# EAGLE design KREM Board (EAGLE 9.3.1)
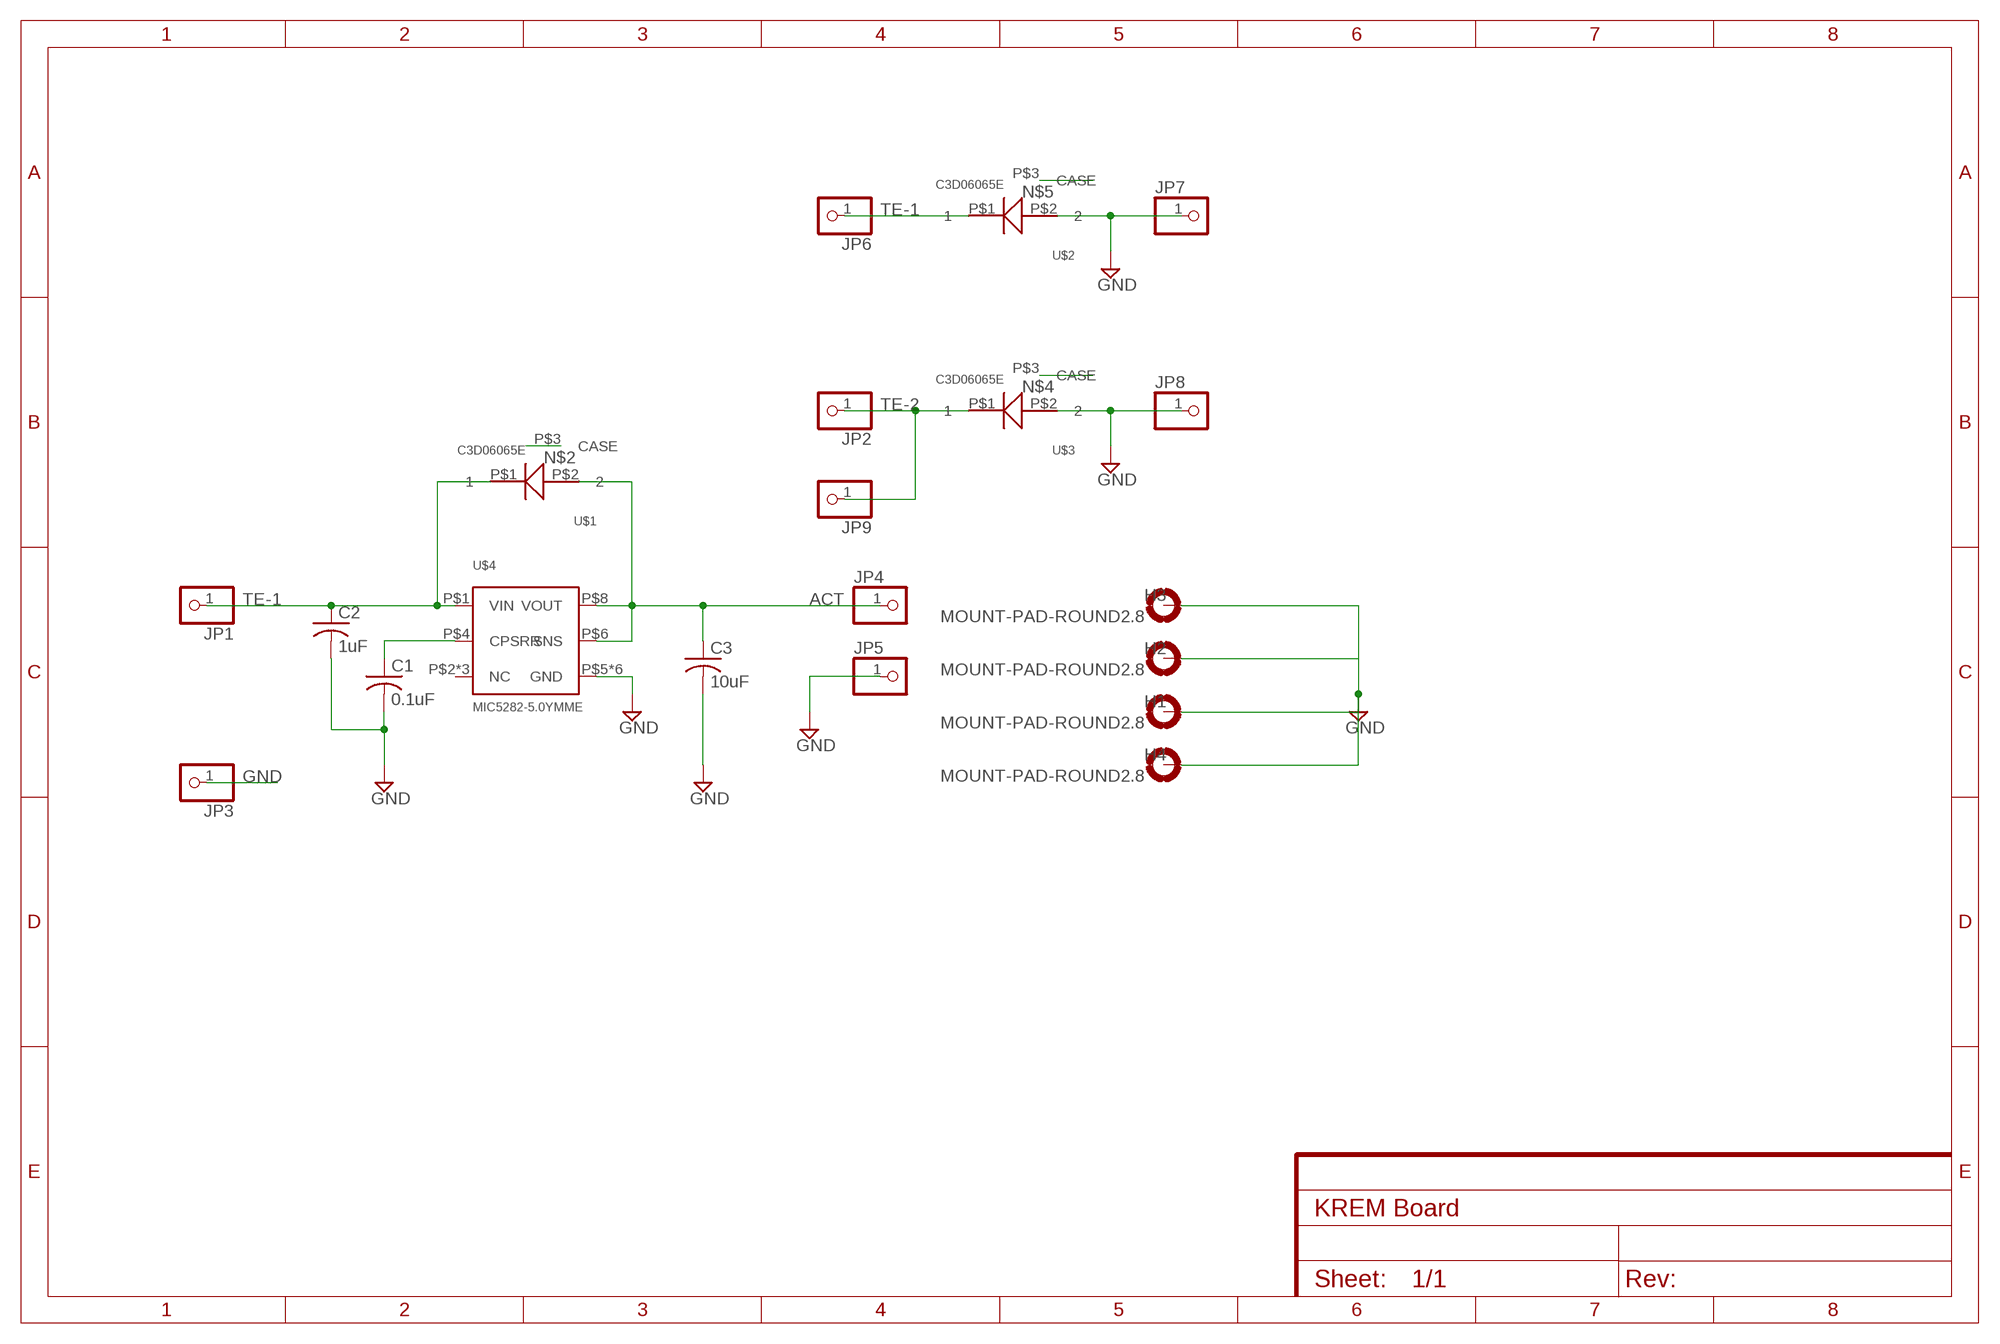
[diagram p0: schematic, sheet 1]

## Parts
C1  0.1uF  C-USC2220K  [C2220K]
C2  1uF  C-USC2220K  [C2220K]
C3  10uF  C-USC2220K  [C2220K]
H1  MOUNT-PAD-ROUND2.8  [2,8-PAD]
H2  MOUNT-PAD-ROUND2.8  [2,8-PAD]
H3  MOUNT-PAD-ROUND2.8  [2,8-PAD]
H4  MOUNT-PAD-ROUND2.8  [2,8-PAD]
JP1  PINHD-1X1  [1X01]
JP2  PINHD-1X1  [1X01]
JP3  PINHD-1X1  [1X01]
JP4  PINHD-1X1  [1X01]
JP5  PINHD-1X1  [1X01]
JP6  PINHD-1X1  [1X01]
JP7  PINHD-1X1  [1X01]
JP8  PINHD-1X1  [1X01]
JP9  PINHD-1X1  [1X01]
U$1  C3D06065E  [TO-252]
U$2  C3D06065E  [TO-252]
U$3  C3D06065E  [TO-252]
U$4  MIC5282-5.0YMME  [MSOP8-EPAD]

## Nets
ACT: C3.1 JP4.1 U$1.P$2 U$4.P$6(SNS) U$4.P$8(VOUT)
GND: C1.2 C2.2 C3.2 H1.B2,8(MOUNT) H2.B2,8(MOUNT) H3.B2,8(MOUNT) H4.B2,8(MOUNT) JP3.1 JP5.1 JP7.1 JP8.1 U$2.P$2 U$3.P$2 U$4.P$5(GND) U$4.P$9(GND) U$4.P$10(GND) U$4.P$11(GND) U$4.P$12(GND) U$4.P$13(GND)
N$2: U$1.P$3(CASE)
N$3: C1.1 U$4.P$4(CPSRR)
N$4: U$3.P$3(CASE)
N$5: U$2.P$3(CASE)
TE-1: C2.1 JP1.1 JP6.1 U$1.P$1 U$2.P$1 U$4.P$1(VIN)
TE-2: JP2.1 JP9.1 U$3.P$1
Unconnected: U$4.P$2(NC) U$4.P$3(NC) U$4.P$7(NC)

## Library data of the parts
C1-C3 = adafruit:C-US: CAPACITOR, American symbol
H1-H4 = holes:MOUNT-PAD-ROUND: MOUNTING PAD, round
JP1-JP9 = adafruit:PINHD-1X1: Pin header 1x1 for 0.1" spacing With round pins
U$1-U$3 = TI_radio:C3D06065E
U$4 = TI_radio:MIC5282-5.0YMME

## Board
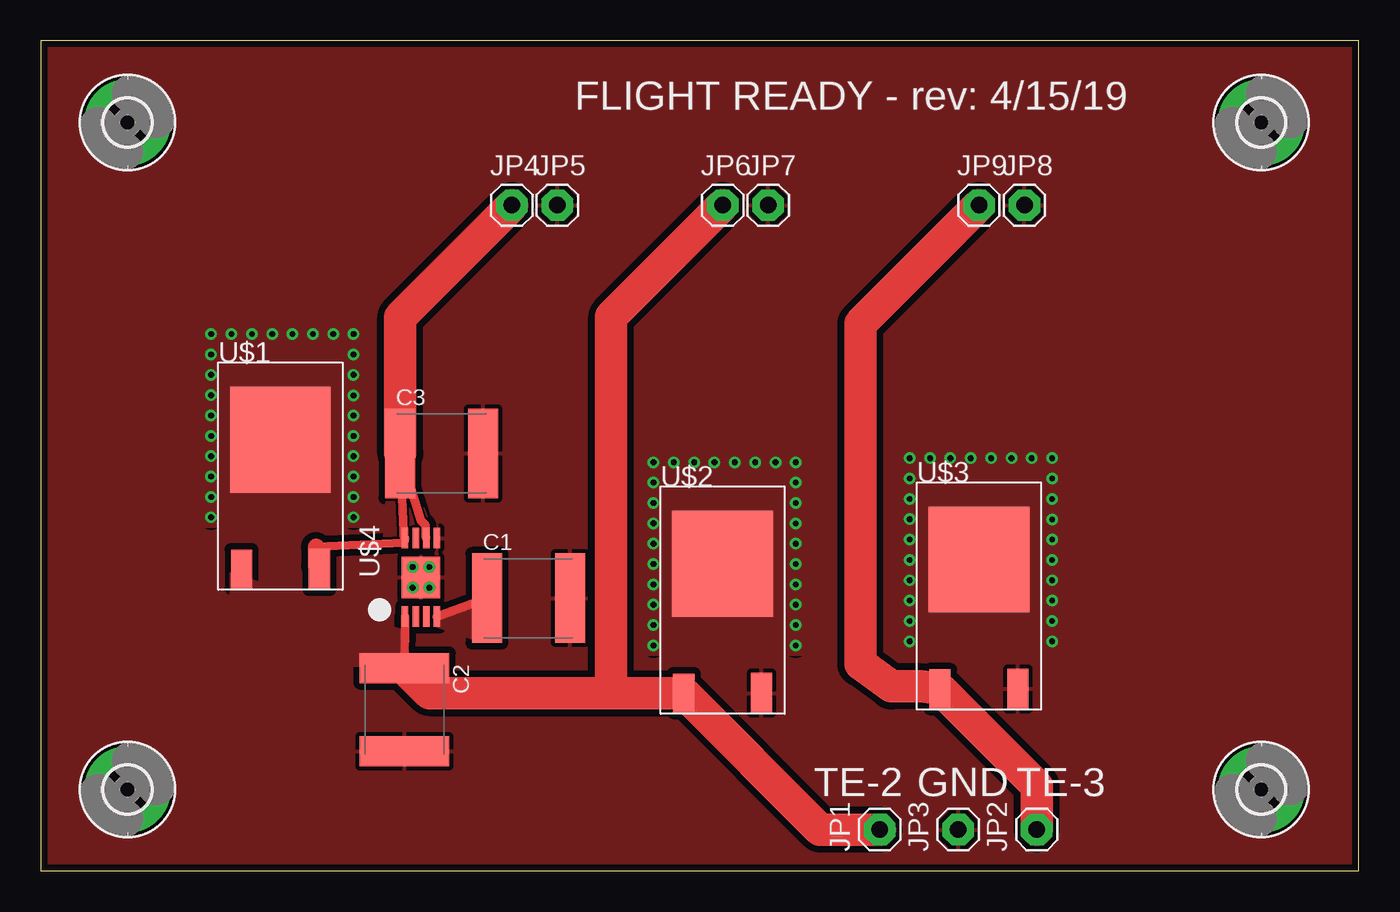
[diagram p1: board, top side]
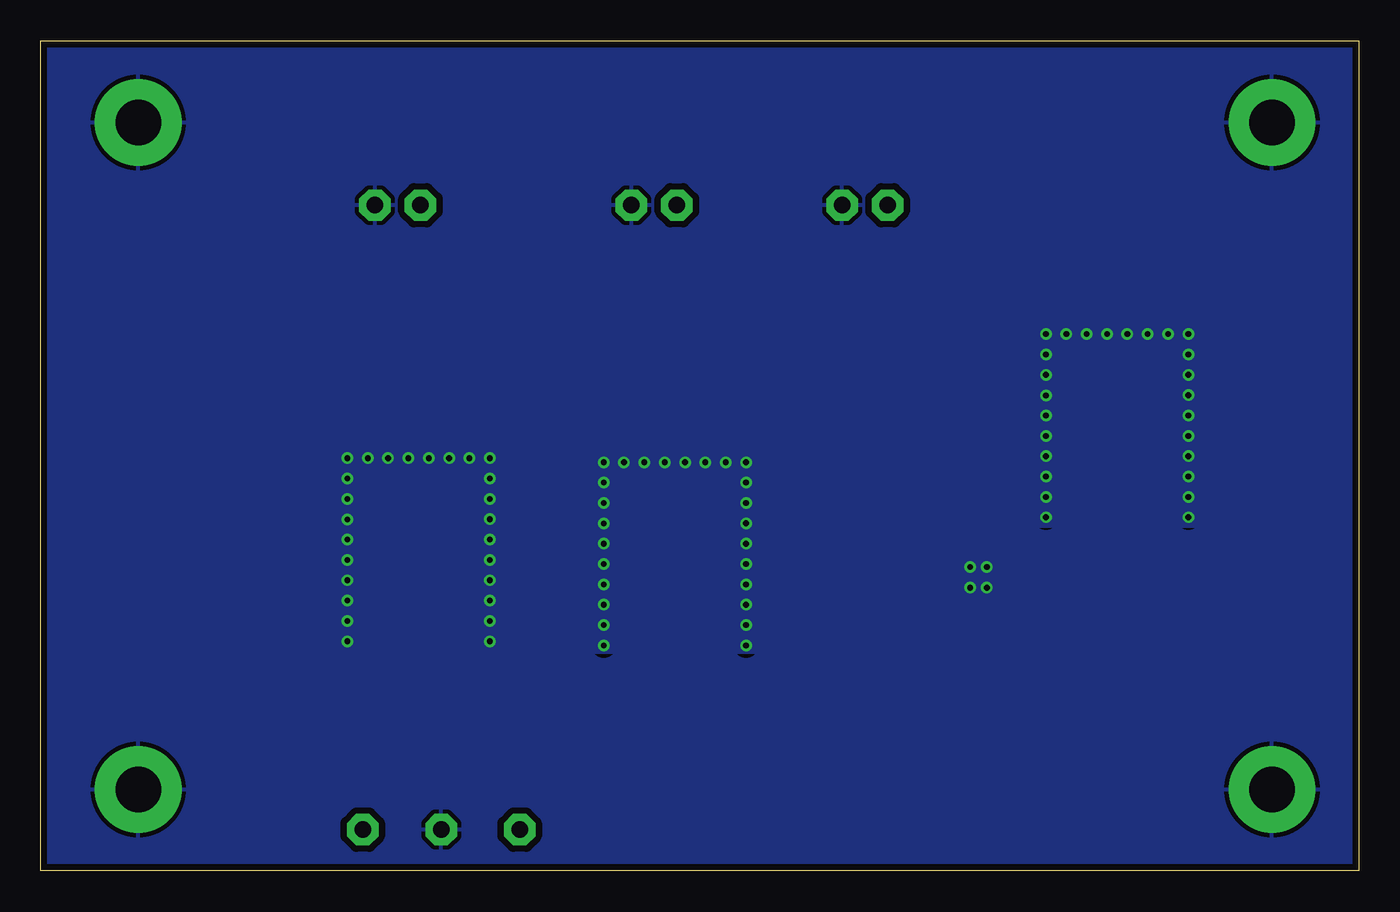
[diagram p2: board, bottom side, seen from below]

Size 81 x 51 mm. Coordinates in mm from the lower left corner, seen from the top.
Outline: 0,0 81,0 81,51 0,51 0,0
Copper layers (1*16): Top 0.0356mm / dielectric 1.5011mm / Bottom 0.0356mm
Design rules "oshpark-2layer *": minimum track width 6mil, minimum drill 13mil, track to track 6mil, track to pad 6mil, pad to pad 6mil, via to via 6mil, smd to smd 6mil, copper to edge 15mil, drill to drill 6mil, minimum pad ring 7mil, minimum via ring 7mil, stop-mask expansion 2.5mil, vias tented up to drill 0mil, thermal gap 10mil

### Footprints (pad centres in the part's own frame; a part is rotated, then mirrored left to right if it is on the bottom)
C2220K = smd 1.85 x 5.5: 1 -2.55,0; 2 2.55,0
2,8-PAD = drill 2.8 pad 5.334: B2,8 0,0
1X01 = drill 1.016 pad 1.93 octagon: 1 0,0
TO-252 = smd 1.3 x 2.4: P$1 -2.39,0 | smd 1.3 x 2.5: P$2 2.39,0 | smd 6.2 x 6.5: P$3 0,7.95
MSOP8-EPAD = smd 1.26 x 0.4: P$1 -2.405,0.975; P$2 -2.405,0.325; P$3 -2.405,-0.325; P$4 -2.405,-0.975; P$5 2.405,-0.975; P$6 2.405,-0.325; P$7 2.405,0.325; P$8 2.405,0.975 | smd 2.55 x 2.35: P$9 0,0 | drill 0.35: P$10 -0.635,0.508; P$11 0.635,0.508; P$12 0.635,-0.508; P$13 -0.635,-0.508

### Placement (x,y rotation side)
C1  29.97,16.76 0 top
C2  22.35,9.91 270 top
C3  24.64,25.65 0 top
H1  5.33,5 0 top
H2  75,5 0 top
H3  5.33,45.97 0 top
H4  75,45.97 0 top
JP1  51.56,2.54 90 top
JP2  61.21,2.54 90 top
JP3  56.39,2.54 90 top
JP4  28.96,40.89 0 top
JP5  31.75,40.89 0 top
JP6  41.91,40.89 0 top
JP7  44.7,40.89 0 top
JP8  60.45,40.89 0 top
JP9  57.66,40.89 0 top
U$1  14.73,18.54 0 top
U$2  41.91,10.92 0 top
U$3  57.66,11.18 0 top
U$4  23.37,18.03 90 top

### Tracks (layer width: path | path; a pad name or v marks a point on that pad's centre or on a via)
ACT
  Top 0.508: 22.32,20.16 C3.1 23.37,21.48 23.41,21.48 23.65,21.24 23.65,20.58 U$4.P$6 | 22.32,20.16 U$4.P$8 | 22.32,20.16 16.91,19.91
  Top 1.016: 16.91,19.91 16.91,18.75 U$1.P$2
  Top 2: C3.1 22.09,34.03 JP4.1
GND
  pour Top (isolate 0.406): -2.79,54.36 -2.79,-2.54 84.33,-2.54 84.33,54.61 84.33,55.88 -2.79,55.88
  pour Bottom (isolate 0.406): -2.29,55.37 -2.29,-2.79 85.85,-2.79 85.85,57.91 -2.54,57.91
N$1
  pour Top (no thermals): 23.88,20.32 23.88,21.34 22.86,24.13 21.34,24.13 21.08,20.32
N$2  (via drill 0.35)
  other vias: 10.48,21.73 10.48,22.98 10.48,24.23 10.48,25.48 10.48,26.73 10.48,27.98 10.48,29.23 10.48,30.48 10.48,31.73 10.48,32.98 11.73,32.98 12.98,32.98 14.23,32.98 15.48,32.98 16.73,32.98 17.98,32.98 19.23,32.98 19.23,31.73 19.23,30.48 19.23,29.21 19.23,27.98 19.23,26.73 19.23,25.48 19.23,24.23 19.23,22.98 19.23,21.73
  pour Top (isolate 0.61, no thermals): 20.17,33.82 20.17,21.19 9.67,21.19 9.67,33.82
  pour Bottom (isolate 0.61, no thermals): 9.54,33.82 9.54,21.19 20.31,21.19 20.31,33.82
N$3
  Top 0.508: U$4.P$4 C1.1
  pour Top (no thermals): 24.38,14.99 26.67,14.22 26.67,16.51 24.38,15.75
N$4  (via drill 0.35)
  other vias: 53.4,14.11 53.4,15.36 53.4,16.61 53.4,17.86 53.4,19.11 53.4,20.36 53.4,21.61 53.4,22.86 53.4,24.11 53.4,25.36 54.65,25.36 55.9,25.36 57.15,25.36 58.4,25.36 59.65,25.36 60.9,25.36 62.15,25.36 62.15,24.11 62.15,22.86 62.15,21.59 62.15,20.36 62.15,19.11 62.15,17.86 62.15,16.61 62.15,15.36 62.15,14.11
  pour Top (isolate 0.61, no thermals): 63.1,26.2 63.1,13.57 52.59,13.57 52.59,26.2
  pour Bottom (isolate 0.61, no thermals): 63.1,13.42 63.1,26.06 52.59,26.06 52.59,13.42
  pour Top (isolate 0.61, no thermals): 63.1,25.95 63.1,13.31 52.59,13.31 52.59,25.95
N$5  (via drill 0.35)
  other vias: 37.65,13.85 37.65,15.1 37.65,16.35 37.65,17.6 37.65,18.85 37.65,20.1 37.65,21.35 37.65,22.6 37.65,23.85 37.65,25.1 38.9,25.1 40.15,25.1 41.4,25.1 42.65,25.1 43.9,25.1 45.15,25.1 46.4,25.1 46.4,23.85 46.4,22.6 46.4,21.34 46.4,20.1 46.4,18.85 46.4,17.6 46.4,16.35 46.4,15.1 46.4,13.85
  pour Top (isolate 0.61, no thermals): 47.35,25.95 47.35,13.31 36.84,13.31 36.84,25.95
  pour Bottom (isolate 0.61, no thermals): 47.35,13.42 47.35,26.06 36.84,26.06 36.84,13.42
TE-1
  Top 0.508: 22.37,12.44 U$4.P$1
  Top 1.27: 22.37,12.44 C2.1
  Top 2: C2.1 23.89,10.92 35.05,10.92 | 35.05,10.92 U$2.P$1 47.9,2.54 JP1.1 | 35.05,10.92 35.05,34.04 JP6.1
  pour Top (no thermals): 11.68,12.95 22.61,12.45 22.35,14.73 11.68,18.29
TE-2
  Top 2: JP2.1 61.21,5.23 U$3.P$1 54.1,11.33 52.27,11.33 50.37,12.72 50.37,33.61 JP9.1

### Text on the board
tNames: FLIGHT READY - rev: 4/15/19 | TE-2 | GND | TE-3